# Altium project PCB_Project.PrjPcb
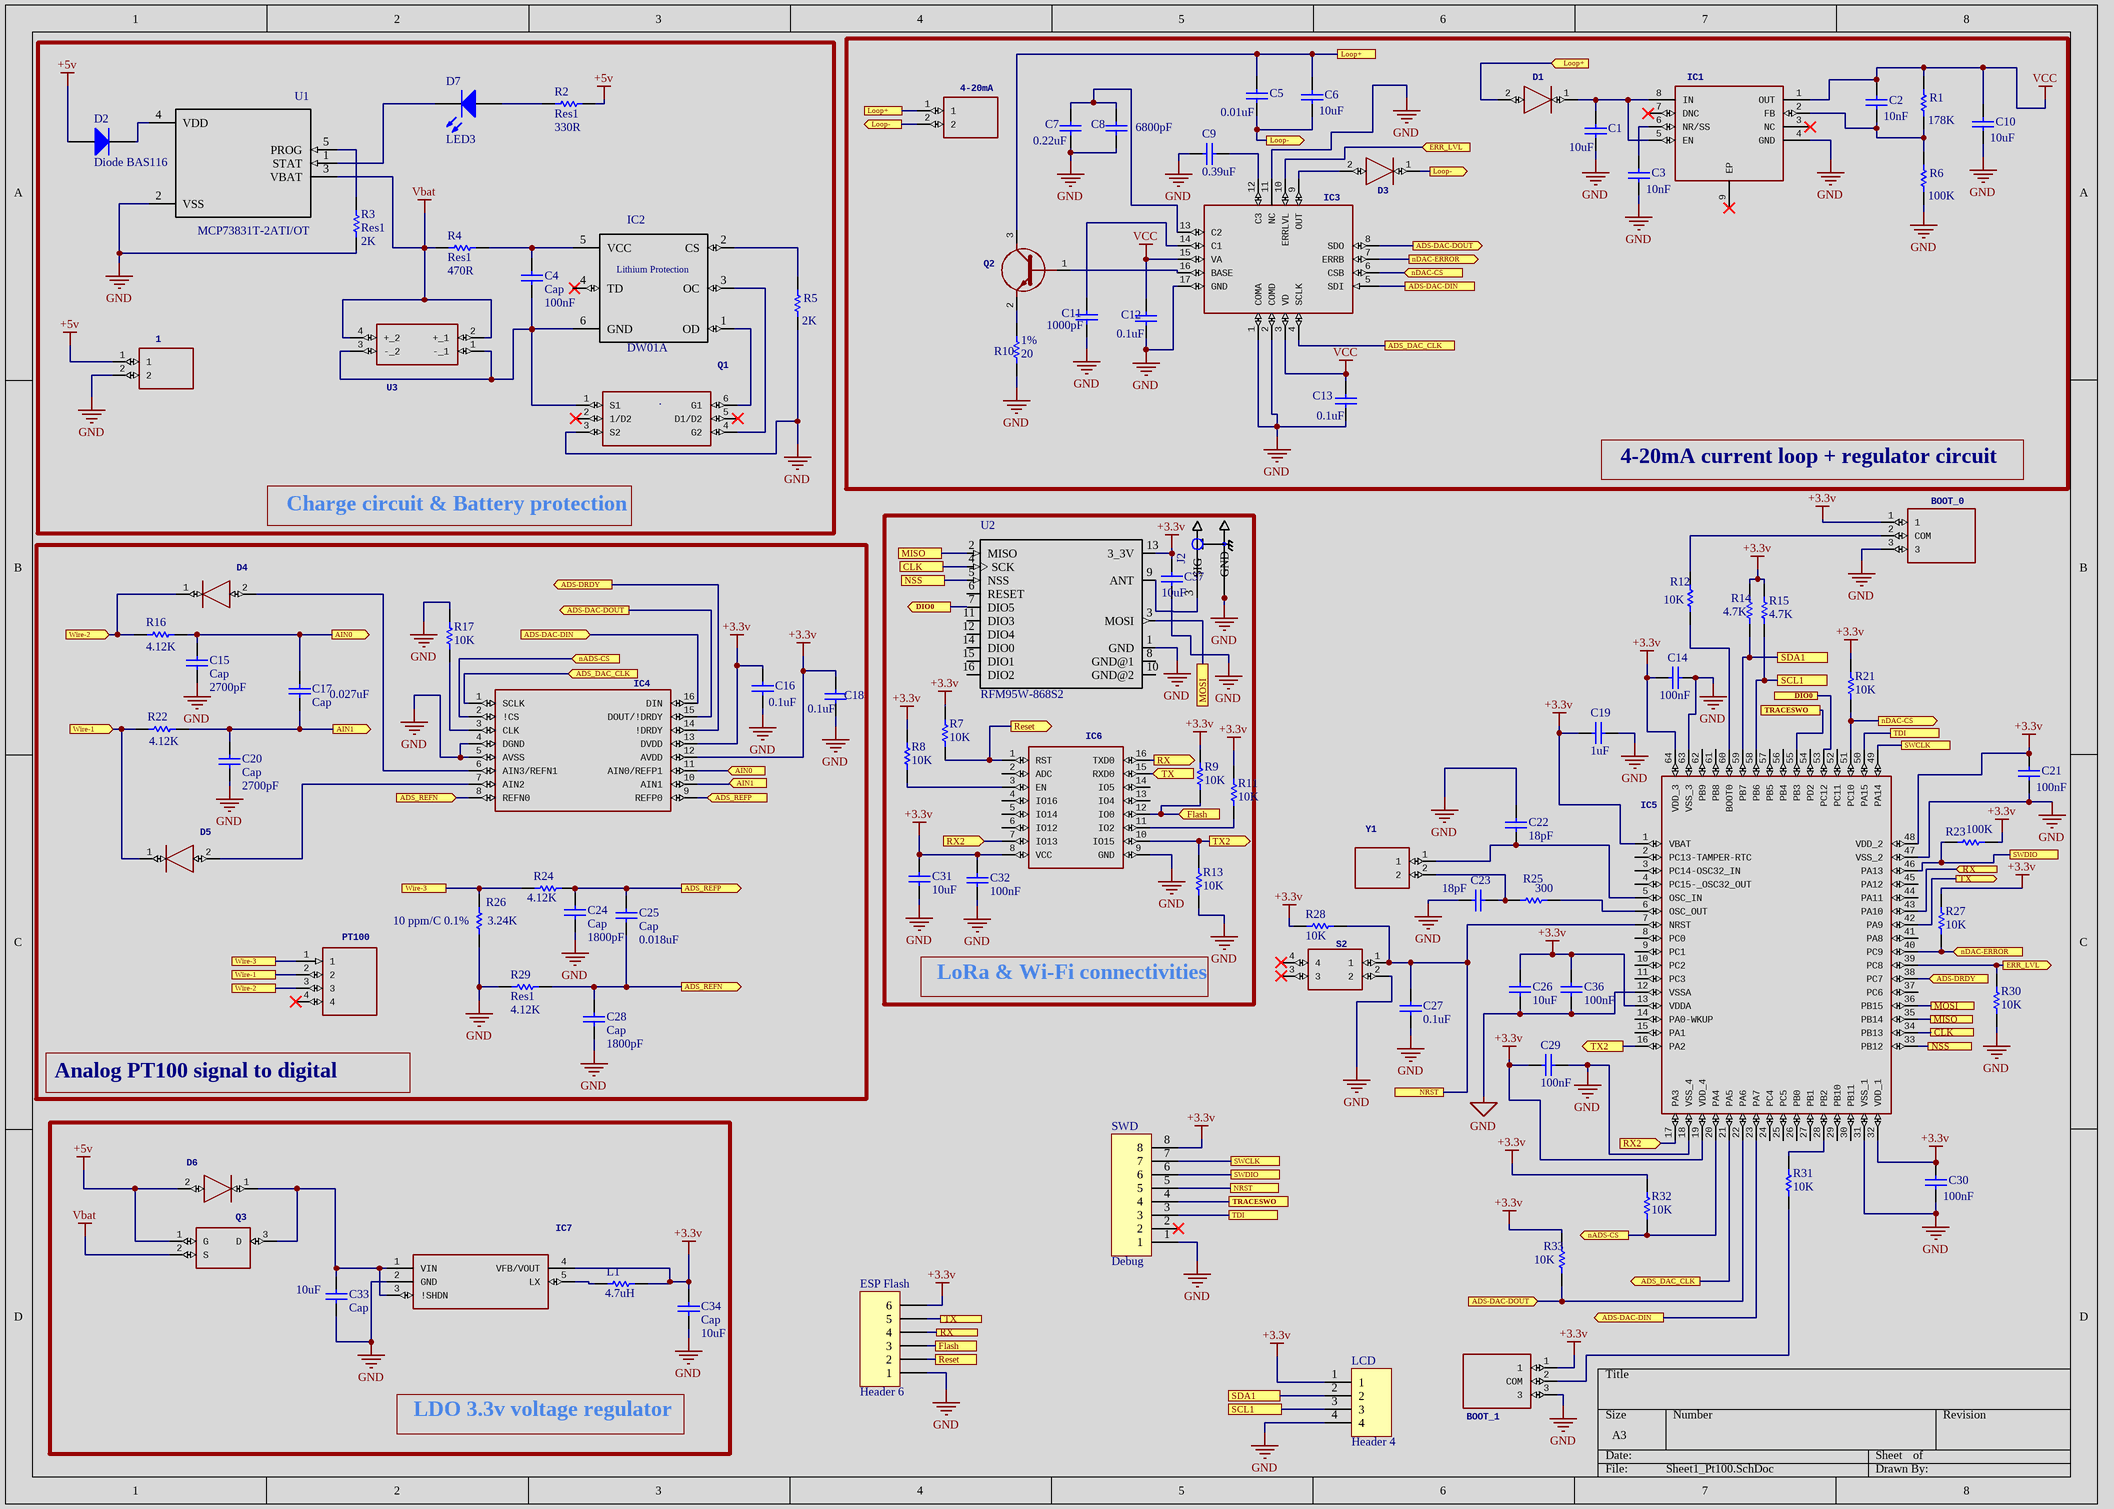
[diagram p0: Sheet1_Pt100.SchDoc]
Title: PT100 iOT Sensor
1 sheet, 98 parts. Net scope: flat (ports and power ports of the same name join across sheets).
Board file: PCB1_Pt100.PcbDoc

## Sheet Sheet1_Pt100.SchDoc: PT100 iOT Sensor
size A3

### Parts
1  P=3.81mm Screw terminal   Source:  Datasheet  [SHDR2W80P0X381_1X2_802X740X880]  (value not drawn)
4-20mA  P=3.81mm Screw terminal   Source:  Datasheet  [SHDR2W80P0X381_1X2_802X740X880]  (value not drawn)
BOOT_0  Slide Switch   Source:  Datasheet  [3PIN_SLIDE_SWITCH]  (value not drawn)
BOOT_1  Slide Switch   Source:  Datasheet  [3PIN_SLIDE_SWITCH]  (value not drawn)
C1  value 10uF  [C1206]
C2  value 10nF  [C1206]
C3  value 10nF  [C1206]
C4  Cap  value 100nF  [C1206]
C5  value 0.01uF  [C1206]
C6  value 10uF  [C1206]
C7  value 0.22uF  [C1206]
C8  value 6800pF  [C1206]
C9  value 0.39uF  [C1206]
C10  value 10uF  [C1206]
C11  value 1000pF  [C1206]
C12  value 0.1uF  [C1206]
C13  value 0.1uF  [C1206]
C14  value 100nF  [C1206]
C15  Cap  value 2700pF  [C1206]
C16  value 0.1uF  [C1206]
C17  Cap  value 0.027uF  [C1206]
C18  value 0.1uF  [C1206]
C19  value 1uF  [C1206]
C20  Cap  value 2700pF  [C1206]
C21  value 100nF  [C1206]
C22  value 18pF  [C1206]
C23  value 18pF  [C1206]
C24  Cap  value 1800pF  [C1206]
C25  Cap  value 0.018uF  [C1206]
C26  value 10uF  [C1206]
C27  value 0.1uF  [C1206]
C28  Cap  value 1800pF  [C1206]
C29  value 100nF  [C1206]
C30  value 100nF  [C1206]
C31  value 10uF  [C1206]
C32  value 100nF  [C1206]
C33  Cap  value 10uF  [C1206]
C34  Cap  value 10uF  [C1206]
C36  value 100nF  [C1206]
C37  value 10uF  [C1206]
D1  Diodes Inc 40V 350mA, Diode, 2-Pin SOD-523 ZHCS350TA   Source:  Datasheet  [SODFL1608X65N]  (value not drawn)
D2  Diode BAS116  [SOT-23_N]
D3  Diodes Inc 40V 350mA, Diode, 2-Pin SOD-523 ZHCS350TA   Source:  Datasheet  [SODFL1608X65N]  (value not drawn)
D4  Diodes Inc 40V 350mA, Diode, 2-Pin SOD-523 ZHCS350TA   Source:  Datasheet  [SODFL1608X65N]  (value not drawn)
D5  Diodes Inc 40V 350mA, Diode, 2-Pin SOD-523 ZHCS350TA   Source:  Datasheet  [SODFL1608X65N]  (value not drawn)
D6  Diode, NXP, PMEG3010ER NXP PMEG3010ER, SMT Schottky Diode, 30V 1A, 2-Pin SOD-123   Source:  Datasheet  [SODFL3517X110N]  (value not drawn)
D7  LED3  [3.5X2.8X1.9]
ESP_Flash  Header 6  [HDR1X6]
IC1  Vin 3V to 36V, 150mA, Ultra-Low-Noise, High-PSRR Low-Dropout (LDO) Linear Regulator   Source:  Datasheet  [SOP65P490X110-9N]  (value not drawn)
IC2  DW01A  [*SOT23-6]
IC3  16-Bit Precision DAC With Internal Reference and 4mA-to-20mA Current Loop Drive   Source:  Datasheet  [QFN50P400X400X80-17N]  (value not drawn)
IC4  24-bit, 2-kSPS, 4-ch, low-power, small-size delta-sigma ADC w/ PGA, VREF, 2x IDACs & SPI interface   Source:  Datasheet  [SOP65P640X120-16N]  (value not drawn)
IC5  STM32F103RBT6, 32 bit ARM Cortex M3 Microcontroller 72MHz 128kb Flash, 20kb RAM, USB I2C SPI 64-Pin LQFP   Source:  Datasheet  [*QFP50P1200X1200X160-64N]  (value not drawn)
IC6  RF SOLUTIONS - ESP-12S - WIFI MODULE, 2.484GHZ, 9 I/O PORT   Source:  Datasheet  [ESP12S]  (value not drawn)
IC7  Sw. Reg. PWM/PFM 2MHz 500mA 3.3V TSOT5   Source:  Datasheet  [SOT95P280X110-5N]  (value not drawn)
J2  U.FL-R-SMT(01)  [*HRS_U.FL-R-SMT(01)]  (value not drawn)
L1  value 4.7uH  [C1206]
LCD  Header 4  [HDR1X4]
PT100  European P.C.B. type terminal blocks  EK series 4 pole   Source:  Datasheet  [SHDR4W90P0X381_1X4_1524X740X85]  (value not drawn)
Q1  Dual N-Channel Enhancement Mode MOSFET   Source:  Datasheet  [SOT95P285X140-6N]  (value not drawn)
Q2  MMBT3904 - NPN switching transistor   Source:  Datasheet  [SOT95P230X110-3N]  (value not drawn)
Q3  INFINEON - IRLML6401TRPBF - MOSFET, P, MICRO3   Source:  Datasheet  [SOT95P237X112-3N]  (value not drawn)
R1  value 178K  [C1206]
R2  Res1  value 330R  [C1206]
R3  Res1  value 2K  [C1206]
R4  Res1  value 470R  [C1206]
R5  value 2K  [C1206]
R6  value 100K  [C1206]
R7  value 10K  [C1206]
R8  value 10K  [C1206]
R9  value 10K  [C1206]
R10  1%  value 20  [C1206]
R11  value 10K  [C1206]
R12  value 10K  [C1206]
R13  value 10K  [C1206]
R14  value 4.7K  [C1206]
R15  value 4.7K  [C1206]
R16  value 4.12K  [C1206]
R17  value 10K  [C1206]
R21  value 10K  [C1206]
R22  value 4.12K  [C1206]
R23  value 100K  [C1206]
R24  value 4.12K  [C1206]
R25  value 300  [C1206]
R26  10 ppm/C 0.1%  value 3.24K  [C1206]
R27  value 10K  [C1206]
R28  value 10K  [C1206]
R29  Res1  value 4.12K  [C1206]
R30  value 10K  [C1206]
R31  value 10K  [C1206]
R32  value 10K  [C1206]
R33  value 10K  [C1206]
S2  IP67 Button Tactile Switch, SPST 50 mA 3.5mm Surface Mount   Source:  Datasheet  [KSC401G50SHLFS]  (value not drawn)
SWD  Debug  [HDR1X8]
U1  MCP73831T-2ATI/OT  [*SOT95P280X145-5N]
U2  RFM95W-868S2  [*XCVR_RFM95W-868S2]
U3  KEYSTONE - 1048 - BATTERY HOLDER, 18650 LI-ION, 2CELL, SMD   Source:  Datasheet  [1048]  (value not drawn)
Y1  Automotive use crystal unit, 2-pin, NX5032GA   Source:  Datasheet  [NX5032GA]  (value not drawn)

### Blocks framed on the sheet
Charge circuit & Battery protection: 1 C4 D2 D7 IC2 Q1 R2-R5 U1 U3
4-20mA current loop + regulator circuit: 4-20mA C1-C3 C5-C13 D1 D3 IC1 IC3 Q2 R1 R6 R10
Analog PT100 signal to digital: C15-C18 C20 C24 C25 C28 D4 D5 IC4 PT100 R16 R17 R22 R24 R26 R29
LoRa & Wi-Fi connectivities: C31 C32 C37 IC6 J2 R7-R9 R11 R13 U2
LDO 3.3v voltage regulator: C33 C34 D6 IC7 L1 Q3

### Ports
ADS-DAC-DIN, ADS-DAC-DIN (in), ADS-DAC-DIN (out), ADS-DAC-DOUT (in), ADS-DAC-DOUT (out), ADS-DRDY (in), ADS-DRDY (out), ADS_DAC_CLK, ADS_DAC_CLK (in), ADS_DAC_CLK (out), ADS_REFN (in), ADS_REFN (out), ADS_REFP (in), ADS_REFP (out), AIN0 (in), AIN0 (out), AIN1 (in), AIN1 (out), CLK, DIO0, DIO0 (out), ERR_LVL (in), ERR_LVL (out), Flash, Flash (in), Loop+, Loop+ (in), Loop- (out), MISO, MOSI, nADS-CS (in), nADS-CS (out), nDAC-CS (in), nDAC-CS (out), nDAC-ERROR (in), nDAC-ERROR (out), NRST, NSS, Reset, Reset (out), RX, RX2 (in), RX (in), RX (out), SCL1, SDA1, SWCLK, SWDIO, TDI, TRACESWO, TX, TX2 (out), TX (in), TX (out), Wire-1, Wire-1 (in), Wire-2, Wire-2 (in), Wire-3

### Nets
+3.3v: BOOT_0.1 BOOT_1.1 C14.2 C16.2 C18.2 C19.1 C21.2 C26.2 C29.2 C30.2 C31.2 C32.2 C34.2 C36.2 C37.2 ESP_Flash.6 IC4.12(AVDD) IC4.13(DVDD) IC5.1(VBAT) IC5.13(VDDA) IC5.19(VDD_4) IC5.32(VDD_1) IC5.48(VDD_2) IC5.64(VDD_3) IC6.8(VCC) IC7.4(VFB/VOUT) L1.1 LCD.1 R7.1 R8.1 R9.1 R11.1 R14.2 R15.2 R21.2 R23.1 R27.2 R28.2 R32.2 R33.2 SWD.8 U2.13(3_3V)
+5v: 1.1 D2.1(A) D6.2(A) Q3.1(G) R2.1
GND: 1.2 BOOT_0.3 BOOT_1.3 C1.1 C3.1 C7.1 C8.1 C9.2 C10.1 C11.1 C12.1 C13.1 C14.1 C15.1 C16.1 C18.1 C19.2 C20.1 C21.1 C22.2 C23.1 C24.1 C26.1 C27.1 C28.1 C29.1 C30.1 C31.1 C32.1 C33.1 C34.1 C36.1 C37.1 ESP_Flash.1 IC1.4(GND) IC3.1(COMA) IC3.2(COMD) IC3.11(NC) IC3.17(GND) IC4.4(DGND) IC4.5(AVSS) IC5.12(VSSA) IC5.18(VSS_4) IC5.31(VSS_1) IC5.47(VSS_2) IC5.63(VSS_3) IC6.9(GND) IC7.2(GND) J2.1(GND) J2.2(GND) LCD.4 Q1.3(S2) R3.1 R5.1 R6.1 R10.2 R13.2 R17.1 R26.1 R29.2 R30.1 S2.2 SWD.1 U1.2(VSS) U2.1(GND)
Vbat: Q3.2(S) R4.1 U1.3(VBAT) U3.2(+_1) U3.4(+_2)
VCC: C2.2 C10.2 C12.2 C13.2 IC1.1(OUT) IC3.3(VD) IC3.15(VA) R1.2
Net4-20mA_1: 4-20mA.1 C5.2 C6.2 D1.2(A) Q2.3(C) ; port Loop+
Net4-20mA_2: 4-20mA.2 C5.1 C6.1 D3.1(K) ; port Loop-
NetBOOT_0_2: BOOT_0.2(COM) R12.2
NetBOOT_1_2: BOOT_1.2(COM) R31.1
NetC1_2: C1.2 D1.1(K) IC1.5(EN) IC1.8(IN)
NetC2_1: C2.1 IC1.2(FB) R1.1 R6.2
NetC3_2: C3.2 IC1.6(NR/SS)
NetC4_1: C4.1 IC2.6(GND) Q1.1(S1) U3.1(-_1) U3.3(-_2)
NetC4_2: C4.2 IC2.5(VCC) R4.2
NetC7_2: C7.2 C8.2 IC3.13(C2)
NetC9_1: C9.1 IC3.12(C3)
NetC11_2: C11.2 IC3.14(C1)
NetC15_2: C15.2 C17.2 IC4.11(AIN0/REFP1) R16.1 ; port AIN0
NetC17_1: C17.1 C20.2 IC4.10(AIN1) R22.1 ; port AIN1
NetC22_1: C22.1 IC5.5(OSC_IN) Y1.1
NetC23_2: C23.2 R25.2 Y1.2
NetC24_2: C24.2 C25.2 IC4.9(REFP0) R24.1 ; port ADS_REFP
NetC25_1: C25.1 C28.2 IC4.8(REFN0) R29.1 ; port ADS_REFN
NetC27_2: C27.2 IC5.7(NRST) R28.1 S2.1 SWD.5 ; port NRST
NetC33_2: C33.2 D6.1(K) IC7.1(VIN) IC7.3(!SHDN) Q3.3(D)
NetD2_3: D2.3(K) U1.4(VDD)
NetD3_2: D3.2(A) IC3.9(OUT)
NetD4_1: D4.1(K) PT100.3 R16.2 ; port Wire-2
NetD4_2: D4.2(A) IC4.6(AIN3/REFN1)
NetD5_1: D5.1(K) PT100.2 R22.2 ; port Wire-1
NetD5_2: D5.2(A) IC4.7(AIN2)
NetD7_1: D7.1(A) R2.2
NetD7_2: D7.2(K) U1.1(STAT)
NetESP_Flash_2: ESP_Flash.2 IC6.1(RST) R7.2 ; port Reset
NetESP_Flash_3: ESP_Flash.3 IC6.12(IO0) R9.2 ; port Flash
NetESP_Flash_4: ESP_Flash.4 IC5.43(PA10) IC6.16(TXD0) ; port RX
NetESP_Flash_5: ESP_Flash.5 IC5.42(PA9) IC6.15(RXD0) ; port TX
NetIC2_1: IC2.1(OD) Q1.6(G1)
NetIC2_2: IC2.2(CS) R5.2
NetIC2_3: IC2.3(OC) Q1.4(G2)
NetIC3_4: IC3.4(SCLK) IC4.1(SCLK) IC5.21(PA5) ; port ADS_DAC_CLK
NetIC3_5: IC3.5(SDI) IC4.16(DIN) IC5.23(PA7) ; port ADS-DAC-DIN
NetIC3_6: IC3.6(CSB) IC5.51(PC10) R21.1 ; port nDAC-CS
NetIC3_7: IC3.7(ERRB) IC5.40(PC9) R27.1 ; port nDAC-ERROR
NetIC3_8: IC3.8(SDO) IC4.15(DOUT/!DRDY) IC5.22(PA6) R33.1 ; port ADS-DAC-DOUT
NetIC3_10: IC3.10(ERRLVL) IC5.39(PC8) R30.2 ; port ERR_LVL
NetIC3_16: IC3.16(BASE) Q2.1(B)
NetIC4_2: IC4.2(!CS) IC5.20(PA4) R32.1 ; port nADS-CS
NetIC4_3: IC4.3(CLK) R17.2
NetIC4_14: IC4.14(!DRDY) IC5.38(PC7) ; port ADS-DRDY
NetIC5_6: IC5.6(OSC_OUT) R25.1
NetIC5_16: IC5.16(PA2) IC6.10(IO15) R13.1 ; port TX2
NetIC5_17: IC5.17(PA3) IC6.7(IO13) ; port RX2
NetIC5_28: IC5.28(PB2) R31.2
NetIC5_33: IC5.33(PB12) U2.5(NSS) ; port NSS
NetIC5_34: IC5.34(PB13) U2.4(SCK) ; port CLK
NetIC5_35: IC5.35(PB14) U2.2(MISO) ; port MISO
NetIC5_36: IC5.36(PB15) U2.3(MOSI) ; port MOSI
NetIC5_46: IC5.46(PA13) R23.2 SWD.6 ; port SWDIO
NetIC5_49: IC5.49(PA14) SWD.7 ; port SWCLK
NetIC5_50: IC5.50(PA15) SWD.3 ; port TDI
NetIC5_53: IC5.53(PC12) U2.7(DIO5) ; port DIO0
NetIC5_55: IC5.55(PB3) SWD.4 ; port TRACESWO
NetIC5_58: IC5.58(PB6) LCD.3 R15.1 ; port SCL1
NetIC5_59: IC5.59(PB7) LCD.2 R14.1 ; port SDA1
NetIC5_60: IC5.60(BOOT0) R12.1
NetIC6_3: IC6.3(EN) R8.2
NetIC6_11: IC6.11(IO2) R11.2
NetIC7_5: IC7.5(LX) L1.2
NetJ2_3: J2.3(SIG) U2.9(ANT)
NetPT100_1: PT100.1 R24.2 R26.2 ; port Wire-3
NetQ2_2: Q2.2(E) R10.1
NetR3_2: R3.2 U1.5(PROG)

Not connected (* = marked no-connect by the designer): IC1 3(NC)* 7(DNC)* 9(EP)*; IC2 4(TD); IC5 2(PC13-TAMPER-RTC) 3(PC14-OSC32_IN) 4(PC15-_OSC32_OUT) 8(PC0) 9(PC1) 10(PC2) 11(PC3) 14(PA0-WKUP) 15(PA1) 24(PC4) 25(PC5) 26(PB0) 27(PB1) 29(PB10) 30(PB11) 37(PC6) 41(PA8) 44(PA11) 45(PA12) 52(PC11) 54(PD2) 56(PB4) 57(PB5) 61(PB8) 62(PB9); IC6 2(ADC) 4(IO16) 5(IO14) 6(IO12) 13(IO4) 14(IO5); PT100 4*; Q1 2(1/D2)* 5(D1/D2)*; S2 3* 4*; SWD 2*; U2 6(RESET) 8(GND@1) 10(GND@2) 11(DIO3) 12(DIO4) 14(DIO0) 15(DIO1) 16(DIO2)

### Notes on the sheet
- (in symbol DW01A) Lithium Protection

### Library data of the parts
1 4-20mA = DB125-3.81-2P: Manufacturer_Name: Dibo; GateName_1: G$1; SymbolName_1: DB125-3.81-2P; LibraryName: DB125-3.81-2P; DeviceSetName: DB125-3.81-2P; Package: SHDR2W80P0X381_1X2_802X740X880; Manufacturer_Part_Number: DB125-3.81-2P; Height: 8.8mm
BOOT_0 BOOT_1 = EG1218: Manufacturer_Name: E-Switch; GateName_1: G$1; SymbolName_1: EG1218; LibraryName: EG1218; DeviceSetName: EG1218; Package: 3PIN_SLIDE_SWITCH; Manufacturer_Part_Number: EG1218; Mouser_Part_Number: 612-EG1218; Mouser_Price-Stock: https://www.mouser.co.uk/ProductDetail/E-Switch/EG1218?qs=xDsBkp9LkocT0c8K%252B5e%2FgA%3D%3D; Height: mm
C1-C34 C36 C37 = Cap: Capacitor; Published: 8-Jun-2000; LatestRevisionDate: 17-Jul-2002; LatestRevisionNote: Re-released for DXP Platform.; PackageReference: RAD-0.3; Publisher: Altium Limited; PackageDescription: Radial Cap, Thru-Hole; 2 Leads; 0.3 in Pin Spacing
D1 D3-D5 = ZHCS350TA: Manufacturer_Name: Diodes Inc.; GateName_1: G$1; Allied_Number: 70438611; SymbolName_1: ZHCS350TA; LibraryName: ZHCS350TA; DeviceSetName: ZHCS350TA; Package: SODFL1608X65N; Manufacturer_Part_Number: ZHCS350TA; Mouser_Part_Number: 522-ZHCS350TA; Mouser_Price-Stock: https://www.mouser.co.uk/ProductDetail/Diodes-Incorporated/ZHCS350TA?qs=%2F4dsY8i%2FUxLp1LQSBxPJBA%3D%3D; RS_Part_Number: 7515168P; RS_Price-Stock: http://uk.rs-online.com/web/p/products/7515168P; Allied_Price-Stock: https://www.alliedelec.com/diodesinc-zhcs350ta/70438611/; Height: 0.65mm
D2 = Diode BAS116: Silicon Low Leakage Diode; Note: Pin 2 is not connected and not drawn.; Published: 21-Mar-2003; LatestRevisionDate: 29-May-2009; LatestRevisionNote: IPC-7351 Footprint Added.; DatasheetVersion: Oct-1999; PackageVersion: Sep-2001; PackageReference: SOT-23; Publisher: Altium Limited; PackageDescription: 3-Pin SOT-23 Package 0.95 mm Pitch, 2.5 mm Lead Span; ComponentLink1Description: Manufacturer Link; ComponentLink1URL: http://www.infineon.com/; ComponentLink2Description: Datasheet; ComponentLink2URL: http://www.infineon.com/upload/Document/cmc_upload/documents/080/656/bas116series.pdf
D6 = PMEG3010ER: Manufacturer_Name: Nexperia; GateName_1: G$1; SymbolName_1: PMEG3010ER; LibraryName: PMEG3010ER; DeviceSetName: PMEG3010ER; Package: SODFL3517X110N; Manufacturer_Part_Number: PMEG3010ER; Mouser_Part_Number: N/A; Mouser_Price-Stock: https://www.mouser.com/Search/Refine.aspx?Keyword=N%2FA; Height: 1.1mm
D7 = LED3: Typical BLUE SiC LED; Published: 8-Jun-2000; LatestRevisionDate: 17-Dec-2003; LatestRevisionNote: PCB Footprint replaced.; DatasheetVersion: 16-Apr-2002; PackageVersion: 16-Apr-2002; PackageReference: 3.5X2.8X1.9; Publisher: Altium Limited; PackageDescription: SM LED; 2 C-Bend Leads; Body 3.5 x 2.8 x 1.9 mm, inc leads (LxWxH typ)
ESP_Flash = Header 6: Header, 6-Pin; LatestRevisionDate: 17-Jul-2002; LatestRevisionNote: Re-released for DXP Platform.; Publisher: Altium Limited
IC1 = TPS7A4901DGNR: Manufacturer_Name: Texas Instruments; GateName_1: G$1; SymbolName_1: TPS7A4901DGNR; LibraryName: TPS7A4901DGNR; DeviceSetName: TPS7A4901DGNR; Package: SOP65P490X110-9N; Manufacturer_Part_Number: TPS7A4901DGNR; Mouser_Part_Number: 595-TPS7A4901DGNR; Mouser_Price-Stock: https://www.mouser.co.uk/ProductDetail/Texas-Instruments/TPS7A4901DGNR?qs=Ze4%2FuFuz19J1%252B3gTImnAgQ%3D%3D; Height: 1.1mm
IC2 = DW01A: One Cell Lithium-ion/Polymer Battery Protection IC; MF: Fortune Semiconductor; Price: None; MP: DW01A; SnapEDA_Link: https://www.snapeda.com/parts/DW01A/Fortune%20Semiconductor/view-part/4388554/?ref=snap; Availability: Unavailable; Package: Package Analog Devices; Value: *
IC3 = DAC161S997RGHR: Manufacturer_Name: Texas Instruments; GateName_1: G$1; SymbolName_1: DAC161S997RGHR; LibraryName: DAC161S997RGHR; DeviceSetName: DAC161S997RGHR; Package: QFN50P400X400X80-17N; Manufacturer_Part_Number: DAC161S997RGHR; Mouser_Part_Number: 595-DAC161S997RGHR; Mouser_Price-Stock: https://www.mouser.co.uk/ProductDetail/Texas-Instruments/DAC161S997RGHR?qs=NKcqT0VB0vDKlEVGENNOUQ%3D%3D; Height: 0.8mm
IC4 = ADS1220IPWR: Manufacturer_Name: Texas Instruments; GateName_1: G$1; SymbolName_1: ADS1220IPWR; LibraryName: ADS1220IPWR; DeviceSetName: ADS1220IPWR; Package: SOP65P640X120-16N; Manufacturer_Part_Number: ADS1220IPWR; Mouser_Part_Number: 595-ADS1220IPWR; Mouser_Price-Stock: https://www.mouser.co.uk/ProductDetail/Texas-Instruments/ADS1220IPWR?qs=5GI1giJCN%252BI6s%2FWJGbZXXQ%3D%3D; Height: 1.2mm
IC5 = STM32F103RBT6: Manufacturer_Name: STMicroelectronics; GateName_1: G$1; Allied_Number: 70391006; SymbolName_1: STM32F103RBT6; LibraryName: STM32F103RBT6; DeviceSetName: STM32F103RBT6; Package: QFP50P1200X1200X160-64N; Manufacturer_Part_Number: STM32F103RBT6; Mouser_Part_Number: 511-STM32F103RBT6; Mouser_Price-Stock: https://www.mouser.co.uk/ProductDetail/STMicroelectronics/STM32F103RBT6?qs=bhCVus9SdFv12dJRZaBmJg%3D%3D; RS_Part_Number: 0402251P; RS_Price-Stock: http://uk.rs-online.com/web/p/products/0402251P; Allied_Price-Stock: http://www.alliedelec.com/stmicroelectronics-stm32f103rbt6/70391006/; Height: 1.6mm
IC6 = ESP-12S: GateName_1: G$1; SymbolName_1: ESP-12S; LibraryName: ESP-12S; DeviceSetName: ESP-12S; Package: ESP12S; Manufacturer_Name: RF SOLUTIONS; Manufacturer_Part_Number: ESP-12S; Mouser_Part_Number: 223-ESP-12S; Mouser_Price-Stock: https://www.mouser.co.uk/ProductDetail/RF-Solutions/ESP-12S?qs=UkDUCjYnTB27YArJ5wHUxg%3D%3D; RS_Part_Number: 1697593; RS_Price-Stock: http://uk.rs-online.com/web/p/products/1697593; Height: 3mm
IC7 = MCP1603T-330I_OS: Manufacturer_Name: Microchip; Manufacturer_Part_Number: MCP1603T-330I/OS; GateName_1: G$1; Allied_Number: 70046434; SymbolName_1: MCP1603T-330I_OS; LibraryName: MCP1603T-330I_OS; DeviceSetName: MCP1603T-330I_OS; Package: SOT95P280X110-5N; Mouser_Part_Number: 579-MCP1603T-330I/OS; Mouser_Price-Stock: https://www.mouser.co.uk/ProductDetail/Microchip-Technology/MCP1603T-330I-OS?qs=usxtMOJb1RzTHtIF7bKmHg%3D%3D; RS_Part_Number: 7386235P; RS_Price-Stock: http://uk.rs-online.com/web/p/products/7386235P; Allied_Price-Stock: http://www.alliedelec.com/microchip-technology-inc-mcp1603t-330i-os/70046434/; Height: 1.1mm
J2 = U.FL-R-SMT(01): U.FL _UMCC_ Connector Receptacle, Male Pin 50Ohm Surface Mount Solder; MF: Hirose; MP: U.FL-R-SMT_01_; Availability: Unavailable; Package: None; SnapEDA_Link: https://www.snapeda.com/parts/U.FL-R-SMT%2801%29/Hirose%20Electric%20Co%20Ltd/view-part/1218914/?ref=snap; Price: None; Value: *
L1 R1-R17 R21-R33 = Res1: Resistor; Published: 8-Jun-2000; LatestRevisionDate: 17-Jul-2002; LatestRevisionNote: Re-released for DXP Platform.; PackageReference: AXIAL-0.3; Publisher: Altium Limited; PackageDescription: Axial Device, Thru-Hole; 2 Leads; 0.3 in Pin Spacing
LCD = Header 4: Header, 4-Pin; LatestRevisionDate: 17-Jul-2002; LatestRevisionNote: Re-released for DXP Platform.; Publisher: Altium Limited
PT100 = EK381V-04P: Manufacturer_Name: Dinkle; GateName_1: G$1; SymbolName_1: EK381V-04P; LibraryName: EK381V-04P; DeviceSetName: EK381V-04P; Package: SHDR4W90P0X381_1X4_1524X740X85; Manufacturer_Part_Number: EK381V-04P; Height: 8.5mm
Q1 = UMW8205A: Manufacturer_Name: UMW; GateName_1: G$1; SymbolName_1: UMW8205A; LibraryName: UMW8205A; DeviceSetName: UMW8205A; Package: SOT95P285X140-6N; Manufacturer_Part_Number: UMW8205A; Height: 1.4mm
Q2 = MMBT3904VL: Manufacturer_Name: Nexperia; GateName_1: G$1; SymbolName_1: MMBT3904VL; LibraryName: MMBT3904VL; DeviceSetName: MMBT3904VL; Package: SOT95P230X110-3N; Manufacturer_Part_Number: MMBT3904VL; Mouser_Part_Number: 771-MMBT3904VL; Mouser_Price-Stock: https://www.mouser.co.uk/ProductDetail/Nexperia/MMBT3904VL?qs=cnAQGvEIVkKbCwIpHJoHxQ%3D%3D; Height: 1.1mm
Q3 = IRLML6401TRPBF: GateName_1: G$1; Allied_Number: 70017403; SymbolName_1: IRLML6401TRPBF; LibraryName: IRLML6401TRPBF; DeviceSetName: IRLML6401TRPBF; Package: SOT95P237X112-3N; Manufacturer_Name: Infineon; Manufacturer_Part_Number: IRLML6401TRPBF; Mouser_Part_Number: 942-IRLML6401TRPBF; Mouser_Price-Stock: https://www.mouser.co.uk/ProductDetail/Infineon-Technologies/IRLML6401TRPBF?qs=9%252BKlkBgLFf1wviSVMCNr8A%3D%3D; RS_Part_Number: 0301316P; RS_Price-Stock: http://uk.rs-online.com/web/p/products/0301316P; Allied_Price-Stock: https://www.alliedelec.com/infineon-irlml6401trpbf/70017403/; Height: 1.12mm
S2 = KSC222GLFS: Manufacturer_Name: C & K COMPONENTS; GateName_1: G$1; SymbolName_1: KSC222GLFS; LibraryName: KSC222GLFS; DeviceSetName: KSC222GLFS; Package: KSC401G50SHLFS; Manufacturer_Part_Number: KSC222GLFS; Mouser_Part_Number: 611-KSC222GLFS; Mouser_Price-Stock: https://www.mouser.co.uk/ProductDetail/CK/KSC222GLFS?qs=8LLMQjkBYsIt%2F%2FXoP9fBVA%3D%3D; RS_Part_Number: 8998582; RS_Price-Stock: http://uk.rs-online.com/web/p/products/8998582; Height: mm
SWD = Header 8: Header, 8-Pin; LatestRevisionDate: 17-Jul-2002; LatestRevisionNote: Re-released for DXP Platform.; Publisher: Altium Limited
U1 = MCP73831T-2ATI/OT: MCP73831 Series Li-Ion/Li-Pol 15 mA - 500 mA 4.2 V Charge Controller - SOT-23-5; MF: Microchip; Price: None; MP: MCP73831T-2ATI/OT; SnapEDA_Link: https://www.snapeda.com/parts/MCP73831T-2ATI/OT/Microchip/view-part/51423/?ref=snap; Availability: Unavailable; Package: SOT-23 Microchip; Value: *
U2 = RFM95W-868S2: RFM95W 869/915MHZ RF Transceiver Module; Price: None; MP: RFM95W-868S2; SnapEDA_Link: https://www.snapeda.com/parts/RFM95W-868S2/RF%20Solutions/view-part/329180/?ref=snap; Availability: Unavailable; Package: SMD-16 Hope Microelectronics; MF: RF; Value: *
U3 = 1048: Manufacturer_Name: Keystone Electronics; GateName_1: G$1; Allied_Number: 70182390; SymbolName_1: 1048; LibraryName: 1048; DeviceSetName: 1048; Package: 1048; Manufacturer_Part_Number: 1048; Mouser_Part_Number: 534-1048; Mouser_Price-Stock: https://www.mouser.com/Search/Refine.aspx?Keyword=534-1048; Allied_Price-Stock: https://www.alliedelec.com/keystone-electronics-1048/70182390/; Height: mm
Y1 = NX5032GA-8.000M-STD-CSU-1: Manufacturer_Name: NDK; GateName_1: G$1; SymbolName_1: NX5032GA-8.000M-STD-CSU-1; LibraryName: NX5032GA-8.000M-STD-CSU-1; DeviceSetName: NX5032GA-8.000M-STD-CSU-1; Package: NX5032GA; Manufacturer_Part_Number: NX5032GA-8.000M-STD-CSU-1; Mouser_Part_Number: 344-NX5032GA8MCSU1; Mouser_Price-Stock: https://www.mouser.co.uk/ProductDetail/NDK/NX5032GA-8000M-STD-CSU-1?qs=55YtniHzbhDXxgRf1t%252Bj4Q%3D%3D; RS_Part_Number: 1847981; RS_Price-Stock: http://uk.rs-online.com/web/p/products/1847981; Height: mm